# Altium schematic sheet USB_HUB_SUPPORT.SchDoc
size Letter; SheetNumber: 11; SheetTotal: 15
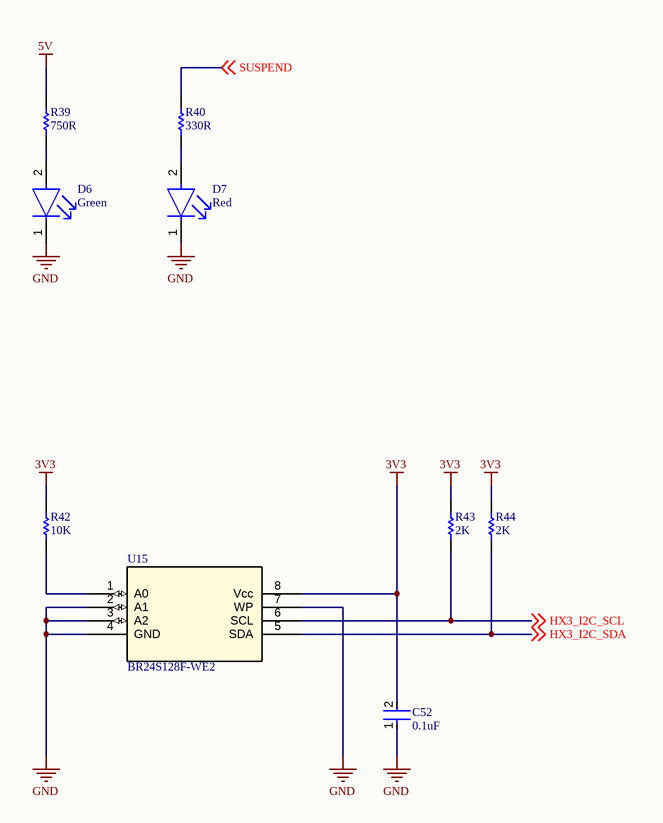
[diagram p0: USB_HUB_SUPPORT.SchDoc]

## Parts
C52  0.1uF  [FP-CC0201-BA-MFG]
D6  Green  [FP-LTST-C190KGKT-MFG]
D7  Red  [FP-LTST-C190KRKT-MFG]
R39  750R  [RESC1005X40X25ML05T05]
R40  330R  [RESC1005X40X25ML05T05]
R42  10K  [RESC1005X40X25ML05T10]
R43  2K  [RESC1005X40X20LL05T10]
R44  2K  [RESC1005X40X20LL05T10]
U15  BR24S128F-WE2  [SOP8_ROM]

## Nets
3V3: C52.2 R42.2 R43.2 R44.2 U15.8(Vcc)
5V: R39.2
GND: C52.1 D6.1(C) D7.1(C) U15.2(A1) U15.3(A2) U15.4(GND) U15.7(WP)
HX3_I2C_SCL: R43.1 U15.6(SCL) ; off-sheet HX3_I2C_SCL
HX3_I2C_SDA: R44.1 U15.5(SDA) ; off-sheet HX3_I2C_SDA
SUSPEND: R40.2 ; off-sheet SUSPEND
NetD6_2: D6.2(A) R39.1
NetD7_2: D7.2(A) R40.1
NetR42_1: R42.1 U15.1(A0)

## Notes on the sheet
- Title
- Copyright (c) Meta Platforms, Inc. and affiliates.
  All rights reserved.
  This source code is licensed under the license found in the
  LICENSE file in the root directory of this source tree.
- Sheet
- of

## Library data of the parts
C52 = CMP-03422-000376-1: CAP CER 0.1UF 6.3V X5R 0201; Manufacturer: Yageo; Manufacturer Part Number: CC0201KRX5R5BB104; Tolerance: 0.1; Temperature Coefficient: 15%; Value: 100 nF; Material: Ceramic; Automotive: No; Device Class L2: Capacitors; Temperature Range High: +85°C; Capacitance: 100 nF; Temperature: -55°C to +85°C; ComponentLink2URL: http://www.yageo.com/documents/recent/UPY-GPHC_X5R_4V-to-50V_25.pdf; Category: Cap; Mouser Description: Multilayer Ceramic Capacitors MLCC - SMD/SMT 100nF 6.3V X5R 10%; Ipc Land Pattern Name: CAPC6030X30; Temperature Characteristic: X5R; Voltage Rating: 6.3 V; Lead Free: Yes; Digikey Description: CAP CER 0.1UF 6.3V X5R 0201; Device Class L1: Passive Components; Octopart: https://octopart.com/cc0201krx5r5bb104-yageo-9292636; Height: 0.33mm; Package: CC0201-BA; Footprint Url: http://www.yageo.com/exep/pages/download/literatures/UPY-C_GEN_24.pdf; ComponentLink2Description: Datasheet; Device Class L3: Ceramic Capacitors; Temperature Range Low: -55°C; RoHS: TRUE
D6 = CMP-2000-05197-2: LED GREEN CLEAR CHIP SMD; Test Current: 20mA; Power Rating: 75mW; Forward Voltage: 2V; Wavelength: 574nm; Number of LEDs: 1; Reverse Voltage: 5V; Dominant Wavelength: 571nm; Lens Style: Diffused; Luminous Intensity: 35mcd; Forward Current: 30mA; Viewing Angle: 130°; Lens Color: Colorless; Width: 0.8mm; Case Code (Imperial): 0603; Case Code (Metric): 1608; Number of Pins: 2; Radiation Hardening: No; Package Quantity: 1; Lead Free: Lead Free; Lens Transparency: Clear; Depth: 0.8mm; Power Dissipation: 75mW; Mount: Surface Mount; Max Operating Temperature: 85°C; Case/Package: 0603; Height: 0.8mm; Illumination Color: Green; Color: Green; Length: 1.6mm; Packaging: Tape and Reel; Number of Elements: 1; Min Operating Temperature: -55°C
D7 = CMP-1674-00011-2: LED RED CLEAR CHIP SMD; Reverse Voltage: 5V; Viewing Angle: 130°; Power Rating: 75mW; Test Current: 20mA; Number of Elements: 1; Lens Color: Colorless; Wavelength: 639nm; Dominant Wavelength: 631nm; Lens Style: Diffused; Forward Current: 30mA; Forward Voltage: 2.4V; Luminous Intensity: 54mcd; Color: Red; Case Code (Imperial): 0603; Lens Transparency: Clear; Lead Free: Lead Free; Package Quantity: 1; Packaging: Tape and Reel; Max Operating Temperature: 85°C; Number of Pins: 2; Height: 0.8mm; Case/Package: 0603; Number of LEDs: 1; Width: 0.8mm; Case Code (Metric): 1608; Depth: 0.8mm; Mount: Surface Mount; Radiation Hardening: No; Length: 1.6mm; Illumination Color: Red; Power Dissipation: 75mW; Min Operating Temperature: -55°C
R39 = CMP-2002-01057-1: Part Number: ERJ-2RKF7500X; Manufacturer: Panasonic
R40 = CMP-2002-01143-1: Manufacturer: Panasonic; Part Number: ERJ2RKF3300X
R42 = CMP-2002-03043-1: Part Number: CRCW040210K0FKEDHP; Manufacturer: Vishay Dale
R43 R44 = CMP-2002-01687-1: Part Number: TNPW04022K00BEED; Manufacturer: Vishay Dale
U15 = BR24S128F-WE2: No Description Available; Mfr_Name: ROHM Semiconductor; Copyright: Copyright (C) 2022 Ultra Librarian. All rights reserved.; Manufacturer_Part_Number: BR24S128F-WE2; Digi-Key_Part_Number_1: BR24S128F-WE2TR-ND; Digi-Key_Part_Number_2: BR24S128F-WE2CT-ND; Digi-Key_Part_Number_3: BR24S128F-WE2DKR-ND; RefDes: RefDes; Type: DEV